# Altium project GSMRelay.PrjPcb
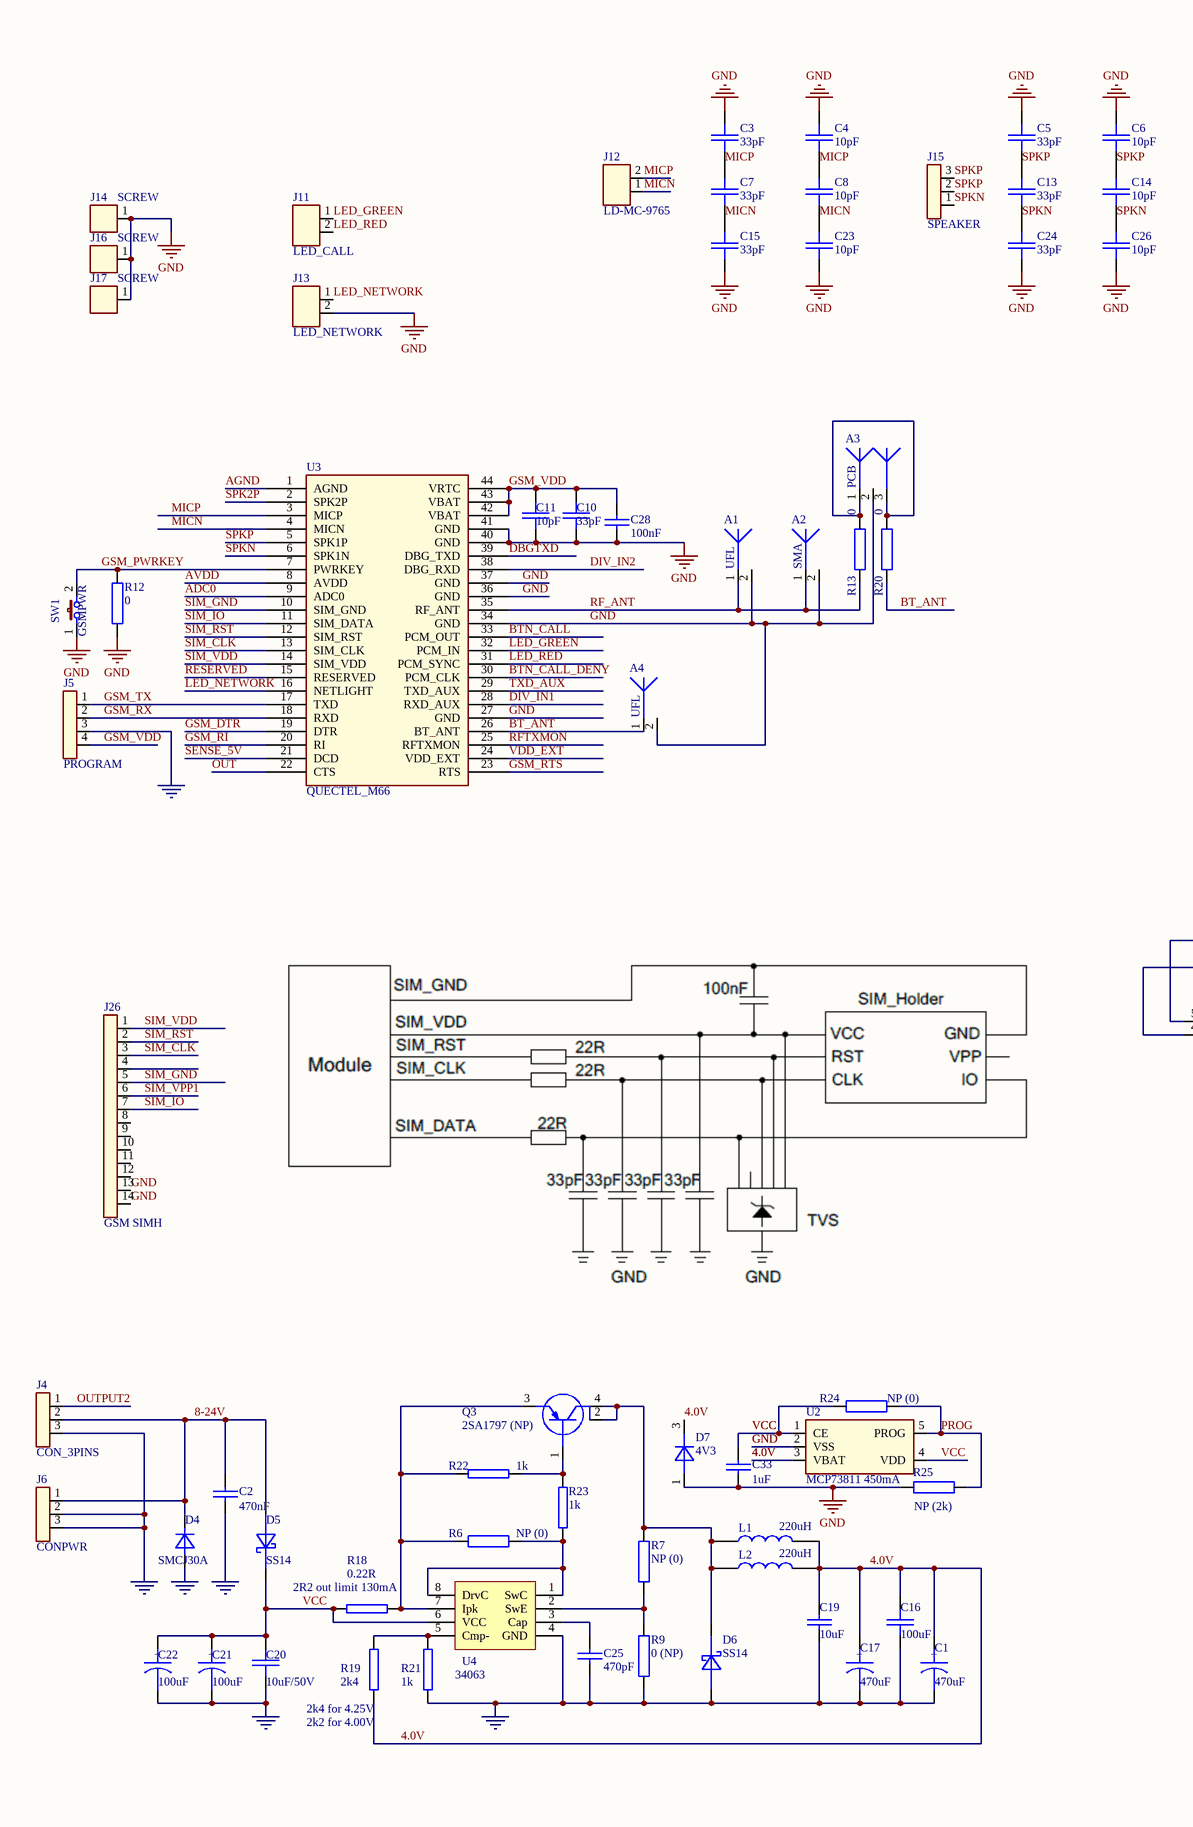
[diagram p0: GSMRelay.SchDoc, left]
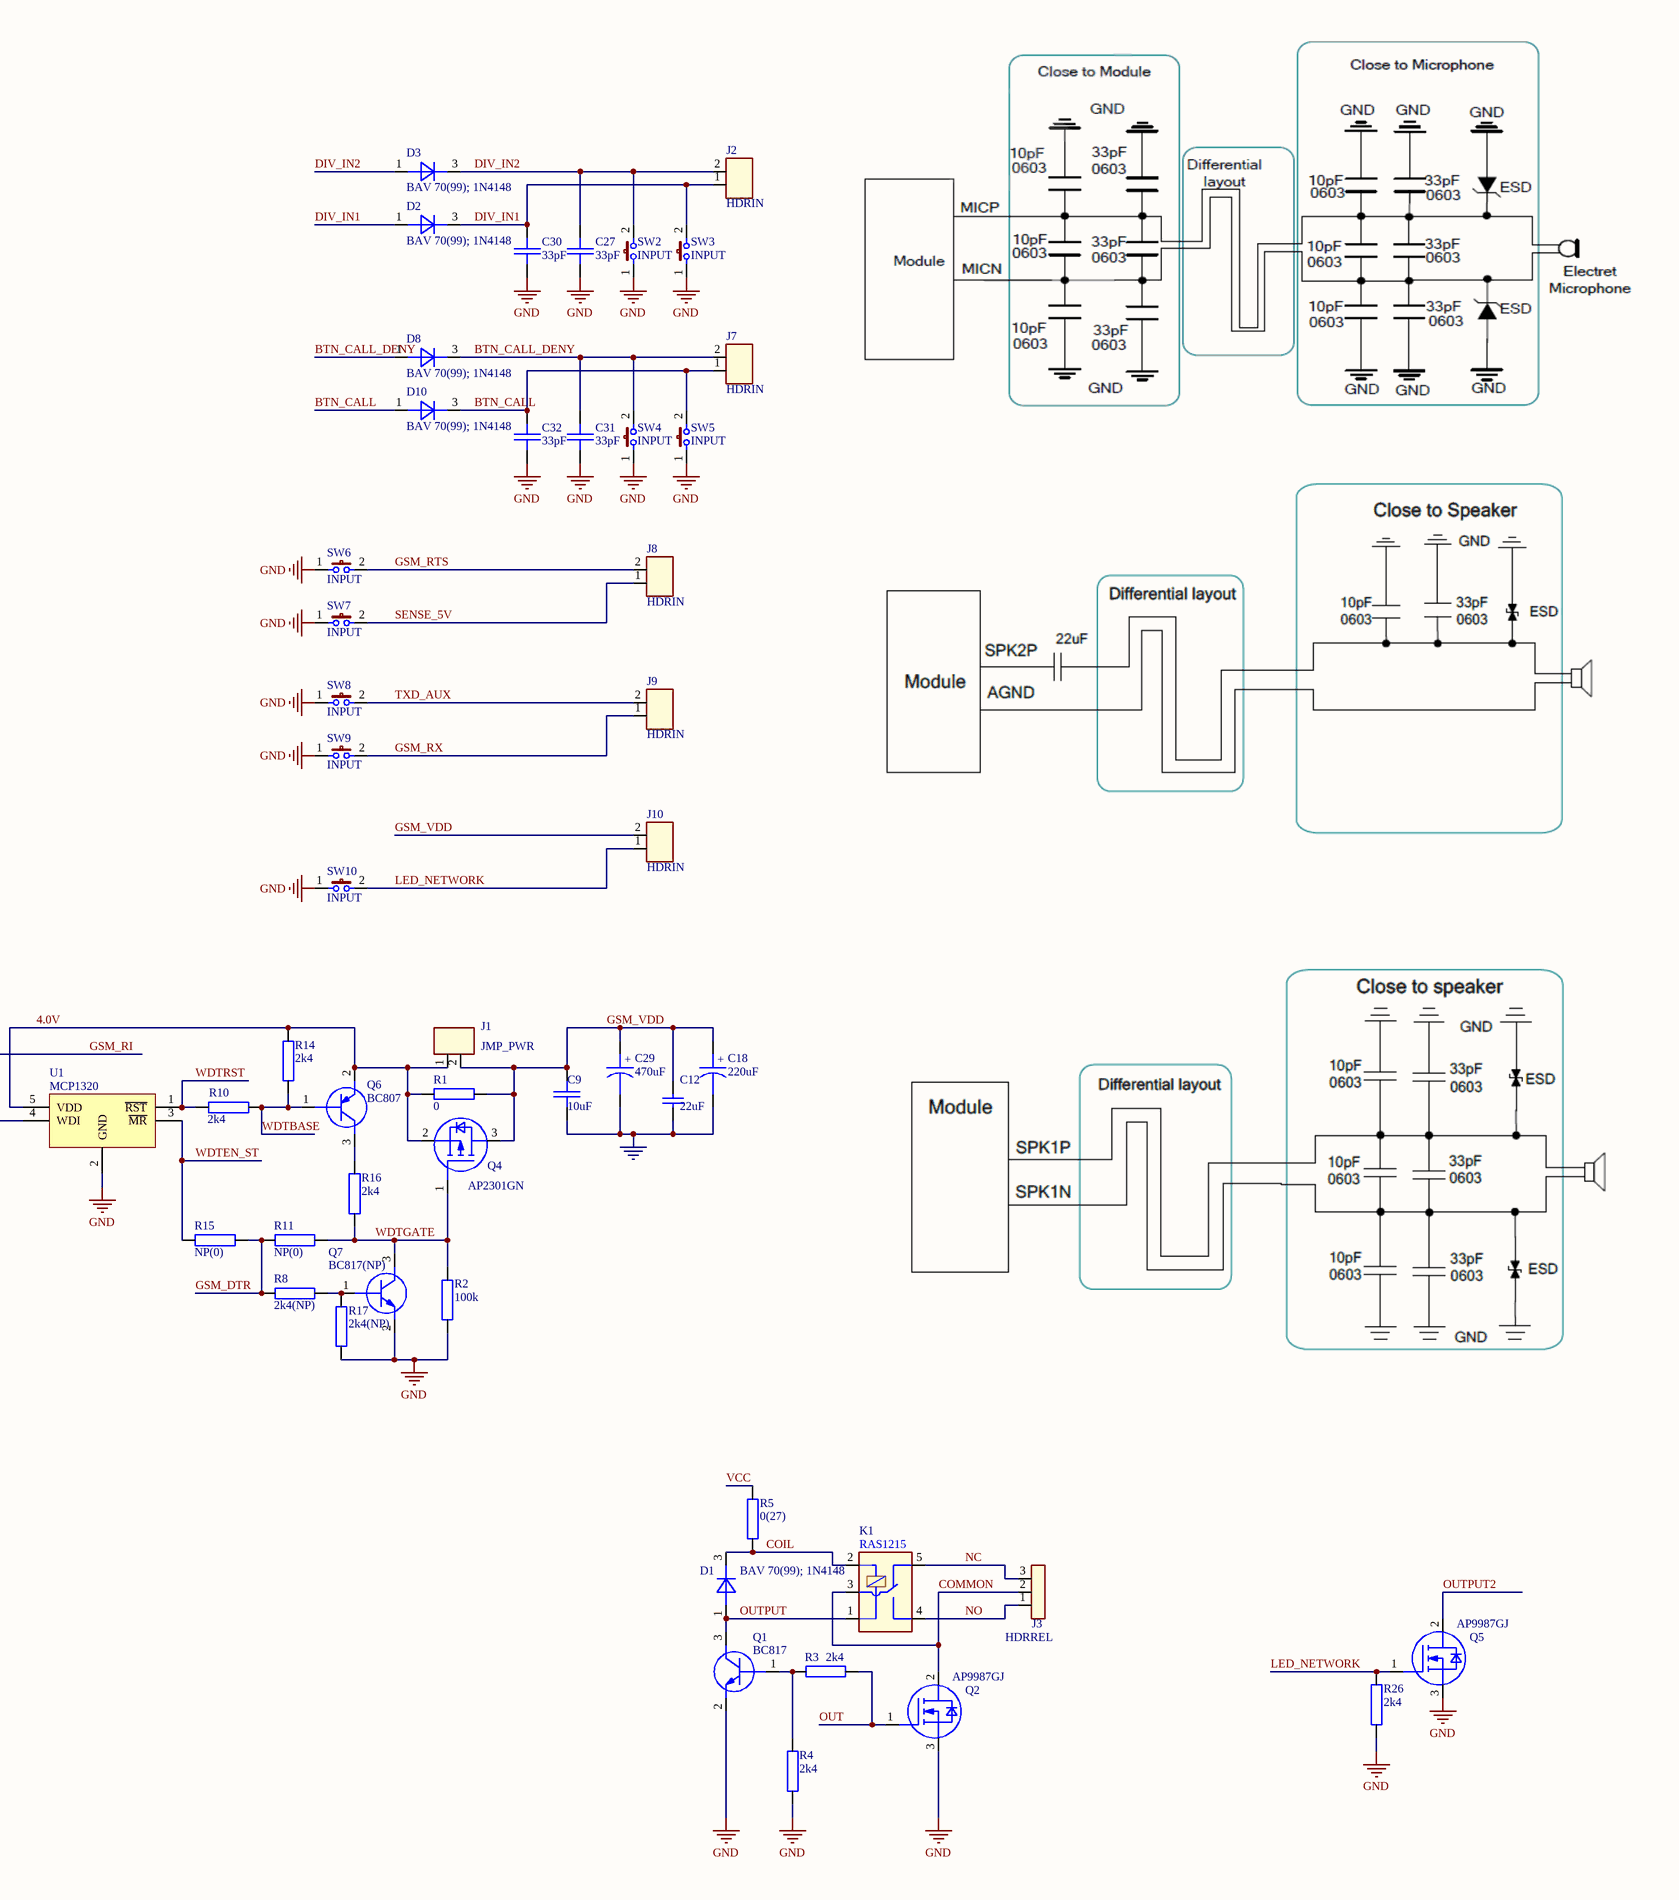
[diagram p1: GSMRelay.SchDoc, right]
1 sheet, 114 parts. Net scope: global (net labels, ports and power ports of the same name join across sheets).
Board file: GSMRelay.PcbDoc

## Sheet GSMRelay.SchDoc
size A2

### Parts
A1  UFL  [SMD_CON_ANTENNA_UFL]
A2  SMA  [SMD_CON_ANTENNA_SMA_RIGHT_ANGLE]
A3  PCB  [SMD_CON_ANTENNA_GSM_WIFI_PCB]
A4  UFL  [SMD_CON_ANTENNA_UFL]
C1  470uF  [SMD_CAPAE660X550N]
C2  470nF  [SMD_0603_CAPC1608X95N]
C3  33pF  [SMD_0603_CAPC1608X95N]
C4  10pF  [SMD_0603_CAPC1608X95N]
C5  33pF  [SMD_0603_CAPC1608X95N]
C6  10pF  [SMD_0603_CAPC1608X95N]
C7  33pF  [SMD_0603_CAPC1608X95N]
C8  10pF  [SMD_0603_CAPC1608X95N]
C9  10uF  [SMD_0805_CAPC2012X95N]
C10  33pF  [SMD_0603_CAPC1608X95N]
C11  10pF  [SMD_0603_CAPC1608X95N]
C12  22uF  [SMD_1210_CAPC3225X279N]
C13  33pF  [SMD_0603_CAPC1608X95N]
C14  10pF  [SMD_0603_CAPC1608X95N]
C15  33pF  [SMD_0603_CAPC1608X95N]
C16  100uF  [SMD_1210_CAPC3225X279N]
C17  470uF  [PTH_CAPPR250-800X800]
C18  220uF  [SMD_CAPAE660X550N]
C19  10uF  [SMD_0805_CAPC2012X95N]
C20  10uF/50V  [SMD_1210_CAPC3225X279N]
C21  100uF  [SMD_CAPAE660X550N]
C22  100uF  [PTH_CAPPR250-800X800]
C23  10pF  [SMD_0603_CAPC1608X95N]
C24  33pF  [SMD_0603_CAPC1608X95N]
C25  470pF  [SMD_0603_CAPC1608X95N]
C26  10pF  [SMD_0603_CAPC1608X95N]
C27  33pF  [SMD_0603_CAPC1608X95N]
C28  100nF  [SMD_0603_CAPC1608X95N]
C29  470uF  [PTH_CAPPR250-800X800]
C30  33pF  [SMD_0603_CAPC1608X95N]
C31  33pF  [SMD_0603_CAPC1608X95N]
C32  33pF  [SMD_0603_CAPC1608X95N]
C33  1uF  [SMD_0603_CAPC1608X95N]
D1  BAV 70(99); 1N4148  [SMD_SOT23_SOT95P240X120-3N]
D2  BAV 70(99); 1N4148  [SMD_SOT23_SOT95P240X120-3N]
D3  BAV 70(99); 1N4148  [SMD_SOT23_SOT95P240X120-3N]
D4  SMCJ30A  [SMD_DO214AC_SMC]
D5  SS14  [SMD_DO214AC_SMA]
D6  SS14  [SMD_DO214AC_SMA]
D7  4V3  [SMD_SOT23_SOT95P240X120-3N]
D8  BAV 70(99); 1N4148  [SMD_SOT23_SOT95P240X120-3N]
D10  BAV 70(99); 1N4148  [SMD_SOT23_SOT95P240X120-3N]
J1  JMP_PWR  [PTH_HDRV02W64P254_1X02]
J2  HDRIN  [PTH_HDRV02W11060P500_1X02]
J3  HDRREL  [PTH_HDRV03W11060P500_1X03]
J4  CON_3PINS  [PTH_HDRV03W11060P500_1X03]
J5  PROGRAM  [PTH_HDRV04W64P254_1X04]
J6  CONPWR  [PTH_DC-POWER-JACK_210-112]
J7  HDRIN  [PTH_HDRV02W11060P500_1X02]
J8  HDRIN  [PTH_HDRV02W11060P500_1X02]
J9  HDRIN  [PTH_HDRV02W11060P500_1X02]
J10  HDRIN  [PTH_HDRV02W11060P500_1X02]
J11  LED_CALL  [PTH_LED-KINGBRIGHT-L-934SGC]
J12  LD-MC-9765  [PTH_MIC_9.6MM_6MM]
J13  LED_NETWORK  [PTH_LED-KINGBRIGHT-L-934SGC]
J14  SCREW  [PTH_MOUNT_HOLE]
J15  SPEAKER  [PTH_SPEAKER_MCABS-227-RC]
J16  SCREW  [PTH_MOUNT_HOLE]
J17  SCREW  [PTH_MOUNT_HOLE]
J26  GSM SIMH  [SMD_CON-ATTEND_SIM_115B-AAA0-R01]
K1  RAS1215  [PTH_REL_RAS]
L1  220uH  [SMD_INDM600500]
L2  220uH  [PTH_CAPPR250-800X800]
Q1  BC817  [SMD_SOT23_SOT95P240X120-3N]
Q2  AP9987GJ  [PTH_TO220AB]
Q3  2SA1797 (NP)  [SMD_SOT89_SOT150P400X130-4N]
Q4  AP2301GN  [SMD_SOT23_SOT95P240X120-3N]
Q5  AP9987GJ  [PTH_TO220AB]
Q6  BC807  [SMD_SOT23_SOT95P240X120-3N]
Q7  BC817(NP)  [SMD_SOT23_SOT95P240X120-3N]
R1  0  [SMD_0603_RESC1608X55N]
R2  100k  [SMD_0603_RESC1608X55N]
R3  2k4  [SMD_0603_RESC1608X55N]
R4  2k4  [SMD_0603_RESC1608X55N]
R5  0(27)  [SMD_0603_RESC1608X55N]
R6  NP (0)  [SMD_0603_RESC1608X55N]
R7  NP (0)  [SMD_0603_RESC1608X55N]
R8  2k4(NP)  [SMD_0603_RESC1608X55N]
R9  0 (NP)  [SMD_0603_RESC1608X55N]
R10  2k4  [SMD_0603_RESC1608X55N]
R11  NP(0)  [SMD_0603_RESC1608X55N]
R12  0  [SMD_0603_RESC1608X55N]
R13  0  [SMD_0402_RESC1005X37N]
R14  2k4  [SMD_0603_RESC1608X55N]
R15  NP(0)  [SMD_0603_RESC1608X55N]
R16  2k4  [SMD_0603_RESC1608X55N]
R17  2k4(NP)  [SMD_0603_RESC1608X55N]
R18  0.22R  [SMD_0805_RESC2012X60N]
R19  2k4  [SMD_0603_RESC1608X55N]
R20  0  [SMD_0402_RESC1005X37N]
R21  1k  [SMD_0603_RESC1608X55N]
R22  1k  [SMD_0603_RESC1608X55N]
R23  1k  [SMD_0603_RESC1608X55N]
R24  NP (0)  [SMD_0603_RESC1608X55N]
R25  NP (2k)  [SMD_0603_RESC1608X55N]
R26  2k4  [SMD_0603_RESC1608X55N]
SW1  GSMPWR  [SMD_SW_DTSM-3]
SW2  INPUT  [SMD_SW_DTSM-3]
SW3  INPUT  [SMD_SW_DTSM-3]
SW4  INPUT  [SMD_SW_DTSM-3]
SW5  INPUT  [SMD_SW_DTSM-3]
SW6  INPUT  [SMD_SW_DTSM-3]
SW7  INPUT  [SMD_SW_DTSM-3]
SW8  INPUT  [SMD_SW_DTSM-3]
SW9  INPUT  [SMD_SW_DTSM-3]
SW10  INPUT  [SMD_SW_DTSM-3]
U1  MCP1320  [SMD_SOT26_SOT95P285X140-5N - DLV]
U2  MCP73811 450mA  [SMD_SOT26_SOT95P285X140-5N - DLV]
U3  QUECTEL_M66  [SMD_MOD_M66-44N]
U4  34063  [SMD_SOIC127P600X175-8N]

### Nets
GND: A1.2 A2.2 A3.2 A4.2 C1.2 C2.2 C3.1 C4.1 C5.1 C6.1 C9.2 C10.2 C11.2 C12.2 C15.2 C16.1 C17.2 C18.2 C19.2 C20.1 C21.2 C22.2 C23.2 C24.2 C25.2 C26.2 C27.2 C28.1 C29.2 C30.2 C31.2 C32.2 C33.1 D4.2(A) D6.2(A) D7.1(A) J4.3 J5.3 J6.2 J6.3 J13.2 J14.1 J16.1 J17.1 J26.13 J26.14 Q1.2(E) Q2.3(S) Q5.3(S) Q7.2(E) R2.1 R4.2 R9.1 R12.2 R17.1 R21.2 R25.2 R26.2 SW1.1 SW2.1 SW3.1 SW4.1 SW5.1 SW6.1 SW7.1 SW8.1 SW9.1 SW10.1 U1.2(GND) U2.2(VSS) U3.27(GND) U3.34(GND) U3.36(GND) U3.37(GND) U3.40(GND) U3.41(GND) U4.4(GND)
4.0V: C1.1 C16.2 C17.1 C19.1 D7.3(C) J1.1 L1.2 L2.2 Q4.2(S) Q6.2(E) R1.1 R14.2 R19.1 U1.5(VDD) U2.3(VBAT)
8-24V: C2.1 D4.1(C) D5.2(A) J4.2 J6.1
ADC0: U3.9(ADC0)
AGND: U3.1(AGND)
AVDD: U3.8(AVDD)
BT_ANT: A4.1 R20.2 U3.26(BT_ANT)
BTN_CALL: C32.1 D10.1(A) D10.3(C) J7.1 SW5.2 U3.33(PCM_OUT)
BTN_CALL_DENY: C31.1 D8.1(A) D8.3(C) J7.2 SW4.2 U3.30(PCM_CLK)
COIL: D1.3(C) K1.2 R5.1
COMMON: J3.2 K1.3 Q2.2(D)
DBGTXD: U3.39(DBG_TXD)
DIV_IN1: C30.1 D2.1(A) D2.3(C) J2.1 SW3.2 U3.28(RXD_AUX)
DIV_IN2: C27.1 D3.1(A) D3.3(C) J2.2 SW2.2 U3.38(DBG_RXD)
GSM_DTR: R8.1 R11.2 R15.2 U3.19(DTR)
GSM_PWRKEY: R12.1 SW1.2 U3.7(PWRKEY)
GSM_RI: U1.4(WDI) U3.20(RI)
GSM_RTS: J8.2 SW6.2 U3.23(RTS)
GSM_RX: J5.2 J9.1 SW9.2 U3.18(RXD)
GSM_TX: J5.1 U3.17(TXD)
GSM_VDD: C9.1 C10.1 C11.1 C12.1 C18.1 C28.2 C29.1 J1.2 J5.4 J10.2 Q4.3(D) R1.2 U3.42(VBAT) U3.43(VBAT) U3.44(VRTC)
LED_GREEN: J11.1 U3.32(PCM_IN)
LED_NETWORK: J10.1 J13.1 Q5.1(G) R26.1 SW10.2 U3.16(NETLIGHT)
LED_RED: J11.2 U3.31(PCM_SYNC)
MICN: C7.2 C8.2 C15.1 C23.1 J12.1 U3.4(MICN)
MICP: C3.2 C4.2 C7.1 C8.1 J12.2 U3.3(MICP)
NC: J3.3 K1.5
NO: J3.1 K1.4
OUT: Q2.1(G) R3.2 U3.22(CTS)
OUTPUT: D1.1(A) K1.1 Q1.3(C)
OUTPUT2: J4.1 Q5.2(D)
PROG: R24.2 R25.1 U2.5(PROG)
RESERVED: U3.15(RESERVED)
RF_ANT: A1.1 A2.1 R13.2 U3.35(RF_ANT)
RFTXMON: U3.25(RFTXMON)
SENSE_5V: J8.1 SW7.2 U3.21(DCD)
SIM_CLK: J26.3 U3.13(SIM_CLK)
SIM_GND: J26.5 U3.10(SIM_GND)
SIM_IO: J26.7 U3.11(SIM_DATA)
SIM_RST: J26.2 U3.12(SIM_RST)
SIM_VDD: J26.1 U3.14(SIM_VDD)
SIM_VPP1: J26.6
SPK2P: U3.2(SPK2P)
SPKN: C13.2 C14.2 C24.1 C26.1 J15.1 U3.6(SPK1N)
SPKP: C5.2 C6.2 C13.1 C14.1 J15.2 J15.3 U3.5(SPK1P)
TXD_AUX: J9.2 SW8.2 U3.29(TXD_AUX)
VCC: C20.2 C21.1 C22.1 C33.2 D5.1(C) R5.2 R18.2 R24.1 U2.1(CE) U2.4(VDD) U4.6(VCC)
VDD_EXT: U3.24(VDD_EXT)
WDTBASE: Q6.1(B) R10.2 R14.1
WDTEN_ST: R15.1 U1.3(~{MR})
WDTGATE: Q4.1(G) Q7.3(C) R2.2 R11.1 R16.1
WDTRST: R10.1 U1.1(~{RST})
NetA3_1: A3.1 A3.3 R13.1 R20.1
NetC25_1: C25.1 U4.3(Cap)
NetD6_1: D6.1(C) L1.1 L2.1 Q3.2(E) Q3.4(C) R7.2
NetQ1_1: Q1.1(B) R3.1 R4.1
NetQ3_1: Q3.1(B) R22.2 R23.1
NetQ3_3: Q3.3(C) R6.2 R18.1 R22.1 U4.7(Ipk)
NetQ6_3: Q6.3(C) R16.2
NetQ7_1: Q7.1(B) R8.2 R17.2
NetR6_1: R6.1 R23.2 U4.1(SwC) U4.8(DrvC)
NetR7_1: R7.1 R9.2 U4.2(SwE)
NetR19_2: R19.2 R21.1 U4.5(Cmp-)

Not connected (* = marked no-connect by the designer): J26 4 8 9 10 11 12

### Notes on the sheet
- (near R18) 2R2 out limit 130mA
- (near R19) 2k4 for 4.25V
- (near R19) 2k2 for 4.00V
- (in symbol CAPACITOR POL) +

### Library data of the parts
A1 A2 A4 = ANTENNA_2: NOTE: <NOTE>
A3 = ANTENNA_3: NOTE: <NOTE>
C1 C17 C18 C21 C22 C29 = CAPACITOR POL: Capacitor
C2 C19 C25 C28 C33 = CAP: Capacitor
C3-C11 C13-C16 C20 C23 C24 C26 C27 C30-C32 = C: NOTE: <NOTE>
C12 = Cap Semi: CL32A227MQVNNNE 220UF 6.3V 20% X5R 1210; Published: 8-Jun-2000; LatestRevisionDate: 29-May-2009; LatestRevisionNote: IPC-7351 Footprint Added.; PackageReference: C1206; Publisher: Altium Limited; PackageDescription: Chip Capacitor; Value: 22uF
D1-D3 D7 D8 D10 = D_A1C3: 1N4148; NOTE: <NOTE>
D4 = D: NOTE: <NOTE>
D5 D6 = D_STKY: NOTE: <NOTE>
J1 J2 J7-J13 = CON_2PINS: NOTE: <NOTE>
J3 J6 J15 = CON_3PINS
J5 = CON_4PINS
J14 J16 J17 = CON_1PIN: NOTE: <NOTE>
J26 = CON_14PINS
K1 = RELAY_SPDT
L1 = INDUCTOR1: FPI0504 DA54
L2 = INDUCTOR1
Q1 Q7 = BJT_NPN_B1E2C3: NOTE: <NOTE>
Q2 Q5 = MOS_N_D1_G1D2S3: NOTE: <NOTE>
Q3 = BJT_PNP_B1C2E3C4: NOTE: <NOTE>
Q4 = MOS_P_D1_G1S2D3: NOTE: <NOTE>
Q6 = BJT_PNP_B1E2C3: NOTE: <NOTE>
R1-R17 R20 R24-R26 = R: NOTE: <NOTE>; R_BDS: R
R18 R19 R21-R23 = RES2
SW1-SW10 = BUTTON_3
U1 = IC_MCP1320: Voltage Supervisor with Watchdog
U2 = IC_MCP73812: MCP73812; DB_PART_NUMBER: PSU000000127; DB_PART_TYPE: Linear Voltage Regulator; DB_MANUFACTURER_PART: ROHM        BD33KA5WF-E2; DB_T_RANGE: -40 to 105; DB_VOLTAGE: 3.3V; DB_CURRENT: 500mA; DB_PACKAGE: SOIC-8; DB_DESCRIPTION: IC BD33KA5WF-E2 SOIC-8; DB_PCB_DEVICE: SMD_SOIC127P620X160-8N; DB_CERTIFIED: ISHIDDEN=T; DB_APPROVED_BY: VSN; DB_APPROVED_ON: 07.5.2014 г. 13:18:28; DB_STATUS: NEW; DB_DATASHEET: http://john.epiqdesign.com/projects/CIS_Datasheets/IC_bdxxka5wf-e-209388.pdf?rev=1408&sc=0
U3 = MOD_QUECTEL_M66
U4 = 34063: DC/DC converter

## Assembly variants
WithTransistor: not fitted A1 A2 A3 A4 C3 C4 C5 C6 C7 C8 C12 C13 C14 C15 C16 C17 C20 C22 C23 C24 C26 C27 C29 C30 C31 C32 C33 D2 D3 D7 D8 D10 J1 J2 J3 J4 J5 J6 J7 J8 J9 J10 J11 J12 J13 J14 J15 J16 J17 K1 L2 Q2 Q5 R1 R6 R7 R11 R15 R24 R25 SW1 SW2 SW3 SW4 SW5 SW6 SW7 SW8 SW9 SW10 U2
Default: not fitted A1 A2 A3 A4 C3 C4 C5 C6 C7 C8 C12 C13 C14 C15 C16 C17 C20 C22 C23 C24 C26 C27 C29 C30 C31 C32 C33 D2 D3 D7 D8 D10 J1 J2 J3 J4 J5 J6 J7 J8 J9 J10 J11 J12 J13 J14 J15 J16 J17 K1 L2 Q2 Q3 Q5 R1 R9 R11 R15 R22 R23 R24 R25 SW1 SW2 SW3 SW4 SW5 SW6 SW7 SW8 SW9 SW10 U2